# Altium schematic sheet Micro.SchDoc
size Tabloid
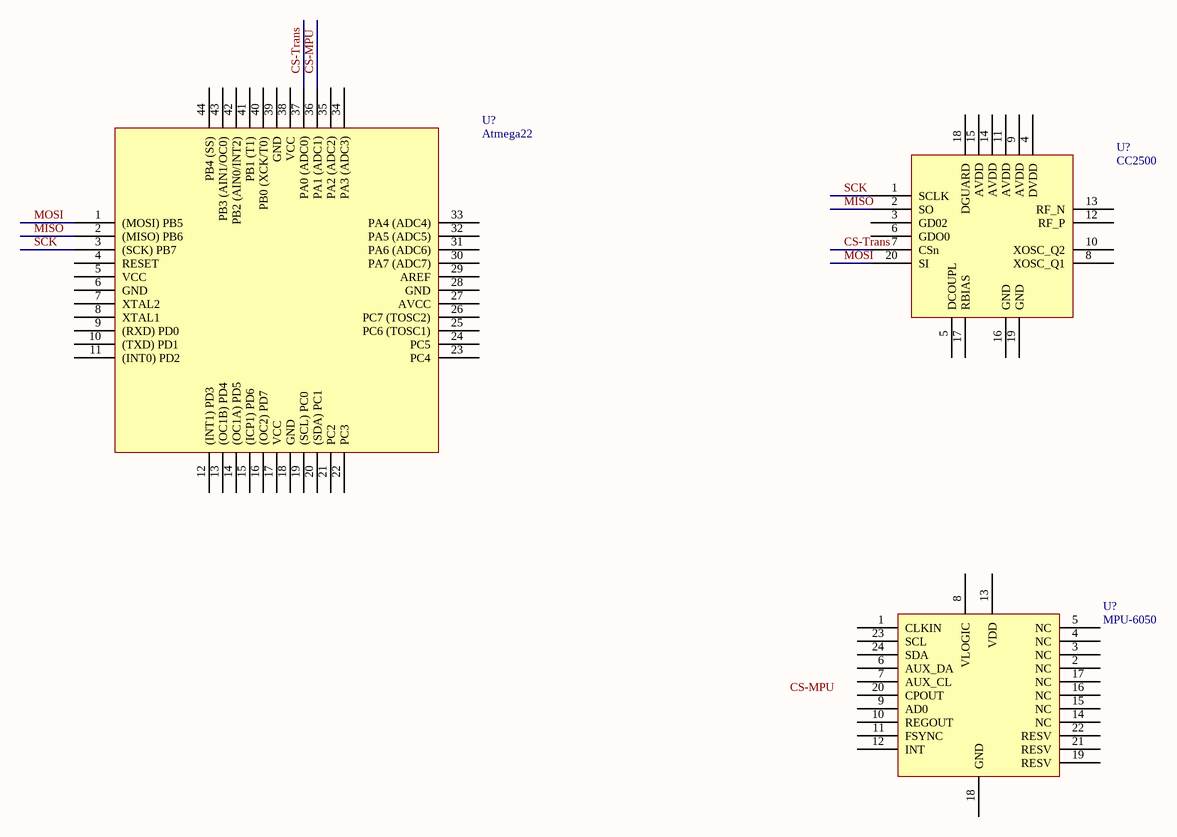
[diagram p0: Micro.SchDoc]

## Parts
(Parts that share a designator on the sheet are numbered #1, #2 ... from top to bottom, then left to right.)
U?#1  CC2500  [RGP (S-PVQFN-N20)]
U?#2  Atmega22  [Quad44]
U?#3  MPU-6050  [QFN24]

## Nets
CS-MPU: U?#2.36(PA1_(ADC1))
CS-Trans: U?#1.7(CSn) U?#2.37(PA0_(ADC0))
MISO: U?#1.2(SO) U?#2.2((MISO)_PB6)
MOSI: U?#1.20(SI) U?#2.1((MOSI)_PB5)
SCK: U?#1.1(SCLK) U?#2.3((SCK)_PB7)

Not connected (* = marked no-connect by the designer): U?#1 3(GD02) 4(DVDD) 5(DCOUPL) 6(GDO0) 8(XOSC_Q1) 9(AVDD) 10(XOSC_Q2) 11(AVDD) 12(RF_P) 13(RF_N) 14(AVDD) 15(AVDD) 16(GND) 17(RBIAS) 18(DGUARD) 19(GND); U?#2 4(RESET) 5(VCC) 6(GND) 7(XTAL2) 8(XTAL1) 9((RXD)_PD0) 10((TXD)_PD1) 11((INT0)_PD2) 12((INT1)_PD3) 13((OC1B)_PD4) 14((OC1A)_PD5) 15((ICP1)_PD6) 16((OC2)_PD7) 17(VCC) 18(GND) 19((SCL)_PC0) 20((SDA)_PC1) 21(PC2) 22(PC3) 23(PC4) 24(PC5) 25(PC6_(TOSC1)) 26(PC7_(TOSC2)) 27(AVCC) 28(GND) 29(AREF) 30(PA7_(ADC7)) 31(PA6_(ADC6)) 32(PA5_(ADC5)) 33(PA4_(ADC4)) 34(PA3_(ADC3)) 35(PA2_(ADC2)) 38(VCC) 39(GND) 40(PB0_(XCK/T0)) 41(PB1_(T1)) 42(PB2_(AIN0/INT2)) 43(PB3_(AIN1/OC0)) 44(PB4_(SS)); U?#3 1(CLKIN) 2(NC) 3(NC) 4(NC) 5(NC) 6(AUX_DA) 7(AUX_CL) 8(VLOGIC) 9(AD0) 10(REGOUT) 11(FSYNC) 12(INT) 13(VDD) 14(NC) 15(NC) 16(NC) 17(NC) 18(GND) 19(RESV) 20(CPOUT) 21(RESV) 22(RESV) 23(SCL) 24(SDA)

## Notes on the sheet
- Labels drawn without touching a wire or pin: CS-MPU

## Library data of the parts
U?#1 = CC2500: Low-Cost Low-Power 2.4 GHz RF Transceiver
U?#2 = ATMEGA 32: IC MCU 8BIT 8KB FLASH 44TQFP
U?#3 = MPU-6050: GYRO/ACCELEROMETER 6AXIS 24QFN